# Altium schematic sheet CPU-POWER.SchDoc
size 292 x 193 mm; SheetNumber: 2; SheetTotal: 4
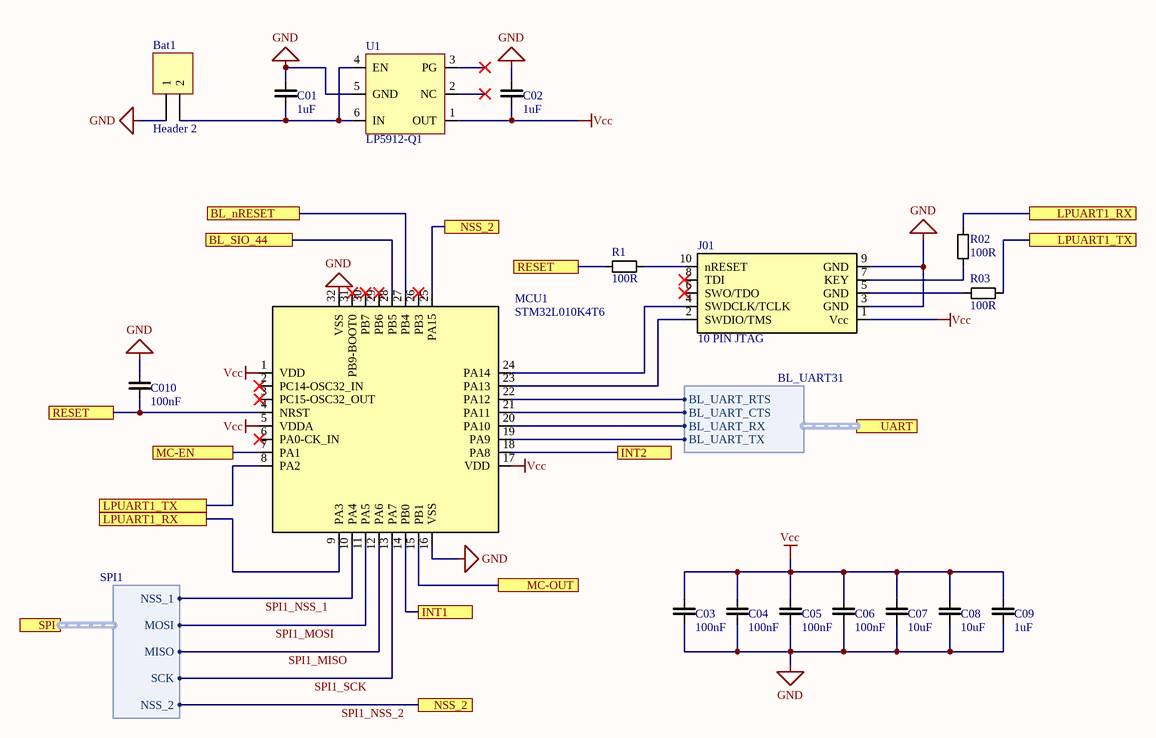
[diagram p0: CPU-POWER.SchDoc]

## Parts
Bat1  Header 2  [HDR1X2]
C01  1uF
C02  1uF
C03  100nF
C04  100nF
C05  100nF
C06  100nF
C07  10uF
C08  10uF
C09  1uF
C010  100nF
J01  10 PIN JTAG
MCU1  STM32L010K4T6
R1  100R
R02  100R
R03  100R
U1  LP5912-Q1

## Ports
BL_nRESET, BL_SIO_44, INT1, INT2, LPUART1_RX, LPUART1_TX, MC-EN, MC-OUT, NSS_2, RESET, SPI (harness SPI1), UART (harness BL_UART31)

## Harnesses
SPI1: NSS_1, MOSI, MISO, SCK, NSS_2
BL_UART31: BL_UART_CTS, BL_UART_RTS, BL_UART_TX, BL_UART_RX

## Nets
GND: Bat1.1 C01.2 C02.2 C03.1 C04.1 C05.1 C06.1 C07.1 C08.1 C09.1 C010.2 J01.3(GND) J01.9(GND) MCU1.16(VSS) MCU1.32(VSS) U1.5(GND)
Vcc: C02.1 C03.2 C04.2 C05.2 C06.2 C07.2 C08.2 C09.2 J01.1(Vcc) MCU1.1(VDD) MCU1.5(VDDA) MCU1.17(VDD) U1.1(OUT)
BL_nRESET: MCU1.27(PB4) ; port BL_nRESET
BL_SIO_44: MCU1.28(PB5) ; port BL_SIO_44
INT1: MCU1.14(PB0) ; port INT1
INT2: MCU1.18(PA8) ; port INT2
LPUART1_RX: MCU1.9(PA3) R02.2 ; port LPUART1_RX
LPUART1_TX: MCU1.8(PA2) R03.1 ; port LPUART1_TX
MC-EN: MCU1.7(PA1) ; port MC-EN
MC-OUT: MCU1.15(PB1) ; port MC-OUT
RESET: C010.1 MCU1.4(NRST) R1.1 ; port RESET
SPI1_MISO: MCU1.12(PA6) ; port SPI.MISO
SPI1_MOSI: MCU1.11(PA5) ; port SPI.MOSI
SPI1_NSS_1: MCU1.10(PA4) ; port SPI.NSS_1
SPI1_NSS_2: MCU1.25(PA15) ; port NSS_2, port SPI.NSS_2
SPI1_SCK: MCU1.13(PA7) ; port SPI.SCK
NetBat1_2: Bat1.2 C01.1 U1.4(EN) U1.6(IN)
NetJ01_2: J01.2(SWDIO/TMS) MCU1.23(PA13)
NetJ01_4: J01.4(SWDCLK/TCLK) MCU1.24(PA14)
NetJ01_5: J01.5(GND) R03.2
NetJ01_7: J01.7(KEY) R02.1
NetJ01_10: J01.10(nRESET) R1.2
NetMCU1_19: MCU1.19(PA9) ; port UART.BL_UART_TX
NetMCU1_20: MCU1.20(PA10) ; port UART.BL_UART_RX
NetMCU1_21: MCU1.21(PA11) ; port UART.BL_UART_CTS
NetMCU1_22: MCU1.22(PA12) ; port UART.BL_UART_RTS

Not connected (* = marked no-connect by the designer): J01 6(SWO/TDO)* 8(TDI)*; MCU1 2(PC14-OSC32_IN)* 3(PC15-OSC32_OUT)* 6(PA0-CK_IN)* 26(PB3)* 29(PB6)* 30(PB7)* 31(PB9-BOOT0)*; U1 2(NC)* 3(PG)*

## Notes on the sheet
- Data:
- Tytuł:
- Rev.:
- Rozm.:
- A4
- Strona:
- z
- PBL4
- Opracował:

## Library data of the parts
Bat1 = Header 2: Header, 2-Pin; LatestRevisionDate: 17-Jul-2002; LatestRevisionNote: Re-released for DXP Platform.; Publisher: Altium Limited
C01 C02 C03 C04 C05 C06 C07 C08 C09 C010 = Cap: Ceramic capacitor
J01 = JTAG
MCU1 = CPU32p
R1 R02 R03 = RES: Resistor
U1 = STAB